# Altium project Main_PCB_EDR.PrjPcb
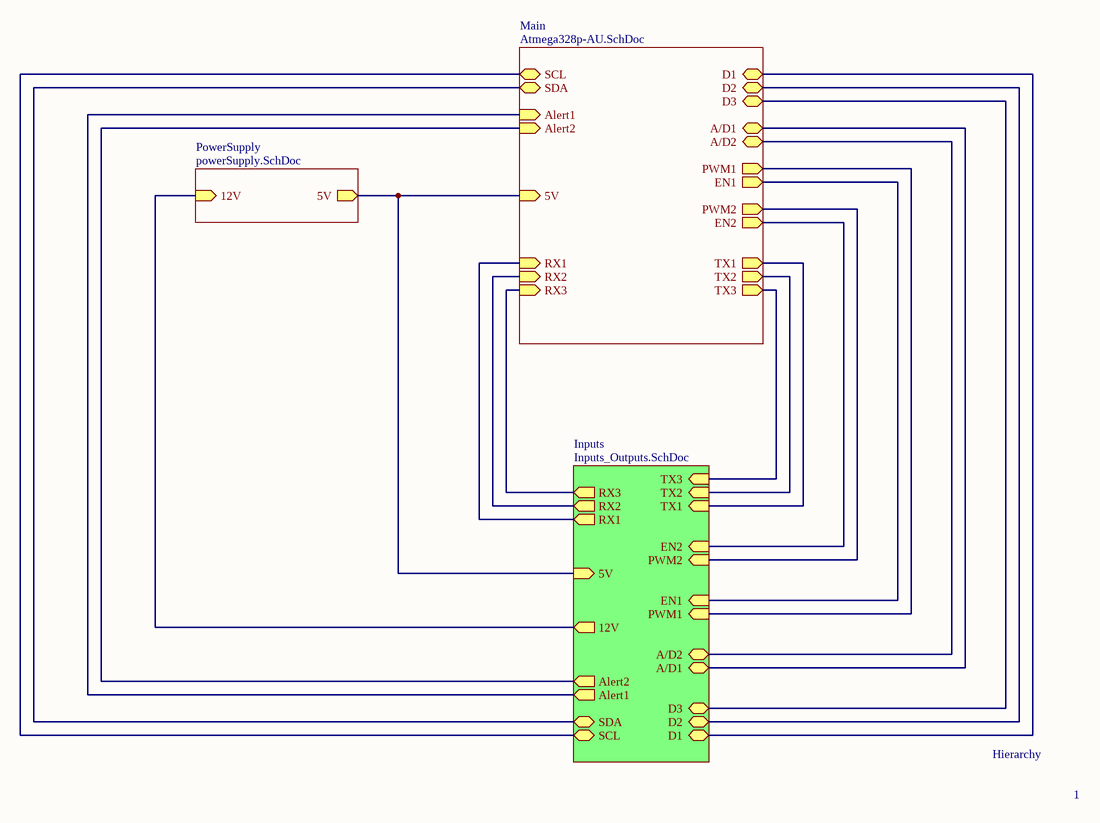
[diagram p0: Hierarchy.SchDoc]
4 sheets, 24 parts. Net scope: hierarchical (ports join the sheet entries above them; power ports are global).
Board file: PCB2.PcbDoc
Sheets:
  Hierarchy.SchDoc
    Main = Atmega328p-AU.SchDoc
    PowerSupply = powerSupply.SchDoc
    Inputs = Inputs_Outputs.SchDoc

## Sheet Hierarchy.SchDoc
size A4; SheetNumber: 1; SheetTotal: 4

### Sub-sheets
Inputs = Inputs_Outputs.SchDoc: Alert1 (out), Alert2 (out), 12V (out), SCL (bidir), SDA (bidir), TX3 (in), TX2 (in), TX1 (in), EN2 (in), PWM2 (in), EN1 (in), PWM1 (in), A/D2 (bidir), A/D1 (bidir), D3 (bidir), D2 (bidir), D1 (bidir), 5V (in), RX1 (out), RX2 (out), RX3 (out)
Main = Atmega328p-AU.SchDoc: PWM1 (out), EN1 (out), PWM2 (out), EN2 (out), 5V (in), Alert1 (in), Alert2 (in), SCL (bidir), SDA (bidir), RX1 (in), RX2 (in), RX3 (in), TX1 (out), TX2 (out), TX3 (out), D2 (bidir), D3 (bidir), D1 (bidir), A/D1 (bidir), A/D2 (bidir)
PowerSupply = powerSupply.SchDoc: 5V (out), 12V (in)

### Nets
+5: sheet Main/5V, sheet PowerSupply/5V, sheet Inputs/5V
NetA/D_1: sheet Main/A/D1, sheet Inputs/A/D1
NetA/D_2: sheet Main/A/D2, sheet Inputs/A/D2
NetC4_2: sheet PowerSupply/12V, sheet Inputs/12V
Netcurrent_sensor_1_1: sheet Main/SCL, sheet Inputs/SCL
Netcurrent_sensor_1_2: sheet Main/SDA, sheet Inputs/SDA
Netcurrent_sensor_1_3: sheet Main/Alert1, sheet Inputs/Alert1
Netcurrent_sensor_2_3: sheet Main/Alert2, sheet Inputs/Alert2
NetD_1: sheet Main/D1, sheet Inputs/D1
NetD_2: sheet Main/D2, sheet Inputs/D2
NetD_3: sheet Main/D3, sheet Inputs/D3
NetH-Bridge1_1: sheet Main/PWM1, sheet Inputs/PWM1
NetH-Bridge1_2: sheet Main/EN1, sheet Inputs/EN1
NetH-Bridge2_1: sheet Main/PWM2, sheet Inputs/PWM2
NetH-Bridge2_2: sheet Main/EN2, sheet Inputs/EN2
NetIC_23: sheet Main/RX1, sheet Inputs/RX1
NetIC_24: sheet Main/TX1, sheet Inputs/TX1
NetIC_25: sheet Main/RX2, sheet Inputs/RX2
NetIC_26: sheet Main/TX2, sheet Inputs/TX2
NetIC_30: sheet Main/RX3, sheet Inputs/RX3
NetIC_31: sheet Main/TX3, sheet Inputs/TX3

### Notes on the sheet
- Hierarchy
- 1

## Sheet Atmega328p-AU.SchDoc
size A4; SheetNumber: 2; SheetTotal: 4
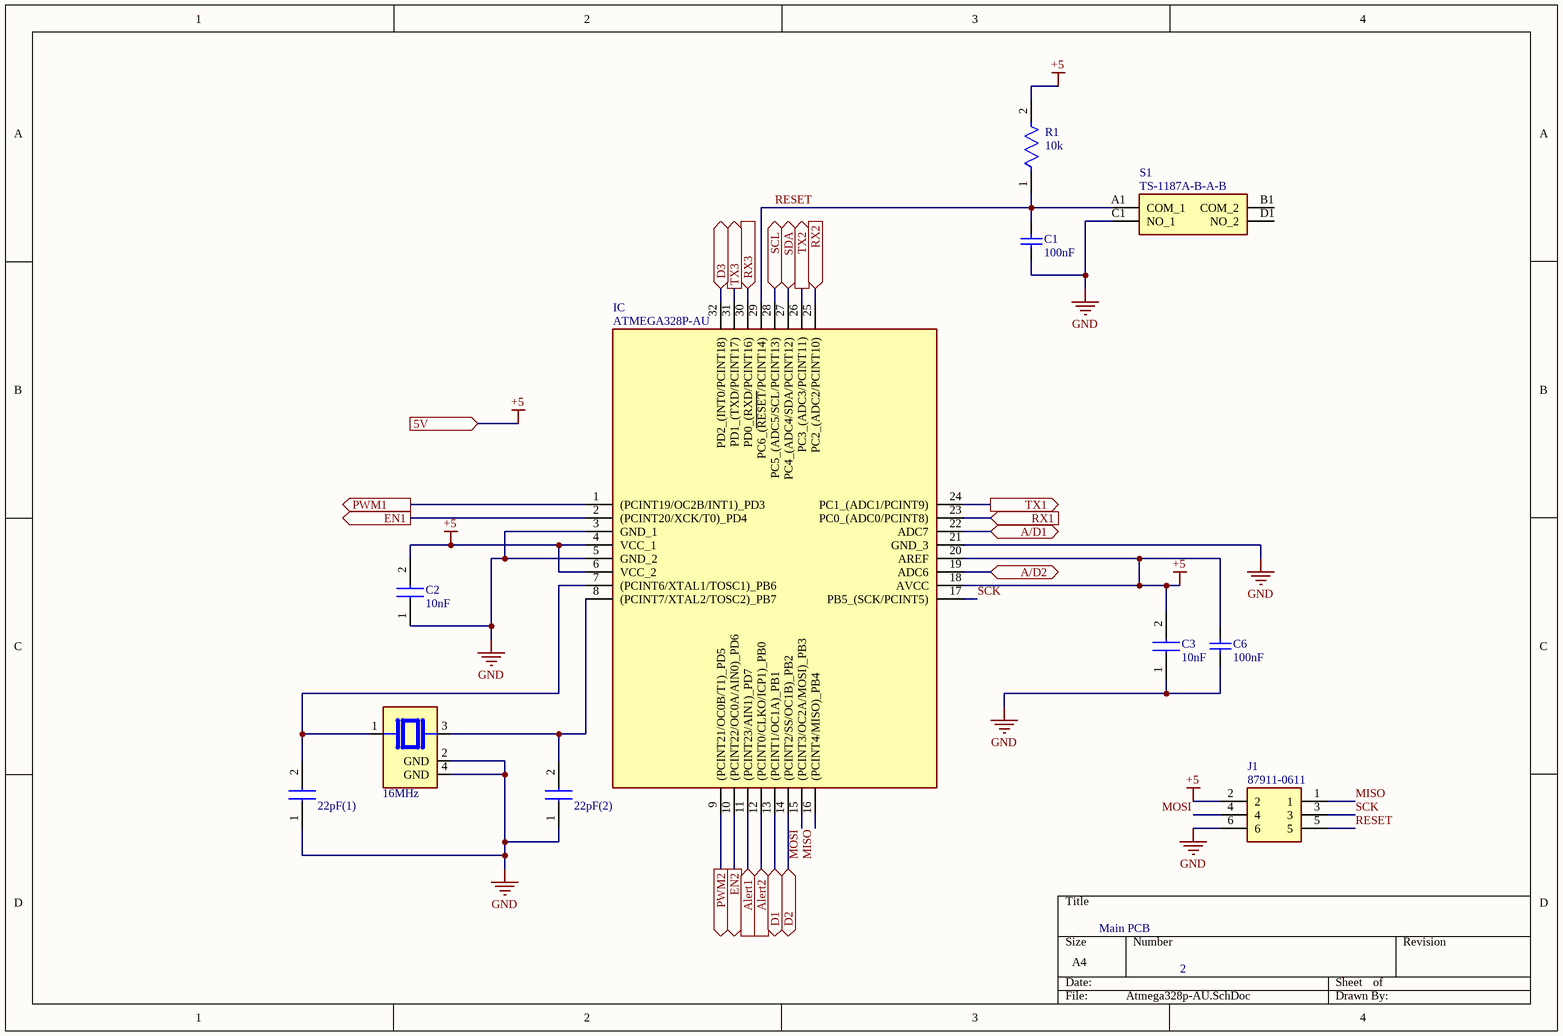
[diagram p1: Atmega328p-AU.SchDoc]

### Parts
16MHz  ABM11-16.000MHz-12-N1G-T  [XTAL_ABM11-16.000MHz-12-N1G-T]  (value not drawn)
22pF(1)  C1206C220JGGACTU  [C1206]  (value not drawn)
22pF(2)  C1206C220JGGACTU  [C1206]  (value not drawn)
C1  Capacitance: 100nF  [AVX-1206-2_L]  (hidden comment: 1206GC102KAT1A)
C2  10nF  [CAPC3216X94N]
C3  10nF  [CAPC3216X94N]
C6  Capacitance: 100nF  [AVX-1206-2_L]  (hidden comment: 1206GC102KAT1A)
IC  ATMEGA328P-AU  [QFP80P900X900X120-32N]
J1  87911-0611  [879110611]
R1  10k  [FP-RC1206-MFG]
S1  TS-1187A-B-A-B  [TS1187ABAB]

### Ports
5V (in, see Hierarchy[2B], Inputs_Outputs[2C], powerSupply[3B]), A/D1 (bidir, see Hierarchy[3B], Inputs_Outputs[3B]), A/D2 (bidir, see Hierarchy[3B], Inputs_Outputs[3B]), Alert1 (in, see Hierarchy[2B], Inputs_Outputs[2B]), Alert2 (in, see Hierarchy[2B], Inputs_Outputs[2B]), D1 (bidir, see Hierarchy[3A], Inputs_Outputs[3C]), D2 (bidir, see Hierarchy[3A], Inputs_Outputs[3C]), D3 (bidir, see Hierarchy[3A], Inputs_Outputs[3C]), EN1 (out, see Hierarchy[3B], Inputs_Outputs[3A]), EN2 (out, see Hierarchy[3B], Inputs_Outputs[3B]), PWM1 (out, see Hierarchy[3B], Inputs_Outputs[3A]), PWM2 (out, see Hierarchy[3B], Inputs_Outputs[3B]), RX1 (in, see Hierarchy[2B], Inputs_Outputs[2C]), RX2 (in, see Hierarchy[2B], Inputs_Outputs[2C]), RX3 (in, see Hierarchy[2B], Inputs_Outputs[2D]), SCL (bidir, see Hierarchy[2A], Inputs_Outputs[2B]), SDA (bidir, see Hierarchy[2A], Inputs_Outputs[2B]), TX1 (out, see Hierarchy[3B], Inputs_Outputs[2C]), TX2 (out, see Hierarchy[3B], Inputs_Outputs[2C]), TX3 (out, see Hierarchy[3B], Inputs_Outputs[2D])

### Nets
+5: C2.2 C3.2 C6.2 IC.4(VCC_1) IC.6(VCC_2) IC.18(AVCC) IC.20(AREF) J1.2 R1.2 ; port 5V
GND: 16MHz.2(GND) 16MHz.4(GND) 22pF(1).1 22pF(2).1 C1.1 C2.1 C3.1 C6.1 IC.3(GND_1) IC.5(GND_2) IC.21(GND_3) J1.6 S1.C1(NO_1)
MISO: IC.16((PCINT4/MISO)_PB4) J1.1
MOSI: IC.15((PCINT3/OC2A/MOSI)_PB3) J1.4
RESET: C1.2 IC.29(PC6_(~{RESET}/PCINT14)) J1.5 R1.1 S1.A1(COM_1)
SCK: IC.17(PB5_(SCK/PCINT5)) J1.3
Net16MHz_1: 16MHz.1 22pF(1).2 IC.7((PCINT6/XTAL1/TOSC1)_PB6)
Net16MHz_3: 16MHz.3 22pF(2).2 IC.8((PCINT7/XTAL2/TOSC2)_PB7)
NetA/D_1: IC.22(ADC7) ; port A/D1
NetA/D_2: IC.19(ADC6) ; port A/D2
Netcurrent_sensor_1_1: IC.28(PC5_(ADC5/SCL/PCINT13)) ; port SCL
Netcurrent_sensor_1_2: IC.27(PC4_(ADC4/SDA/PCINT12)) ; port SDA
Netcurrent_sensor_1_3: IC.11((PCINT23/AIN1)_PD7) ; port Alert1
Netcurrent_sensor_2_3: IC.12((PCINT0/CLKO/ICP1)_PB0) ; port Alert2
NetD_1: IC.13((PCINT1/OC1A)_PB1) ; port D1
NetD_2: IC.14((PCINT2/SS/OC1B)_PB2) ; port D2
NetD_3: IC.32(PD2_(INT0/PCINT18)) ; port D3
NetH-Bridge1_1: IC.1((PCINT19/OC2B/INT1)_PD3) ; port PWM1
NetH-Bridge1_2: IC.2((PCINT20/XCK/T0)_PD4) ; port EN1
NetH-Bridge2_1: IC.9((PCINT21/OC0B/T1)_PD5) ; port PWM2
NetH-Bridge2_2: IC.10((PCINT22/OC0A/AIN0)_PD6) ; port EN2
NetIC_23: IC.23(PC0_(ADC0/PCINT8)) ; port RX1
NetIC_24: IC.24(PC1_(ADC1/PCINT9)) ; port TX1
NetIC_25: IC.25(PC2_(ADC2/PCINT10)) ; port RX2
NetIC_26: IC.26(PC3_(ADC3/PCINT11)) ; port TX2
NetIC_30: IC.30(PD0_(RXD/PCINT16)) ; port RX3
NetIC_31: IC.31(PD1_(TXD/PCINT17)) ; port TX3

Not connected (* = marked no-connect by the designer): S1 B1(COM_2) D1(NO_2)

### Notes on the sheet
- Main PCB
- 2

### Library data of the parts
16MHz = ABM11-16.000MHz-12-N1G-T: MF: {'manufacturer': u'Abracon LLC'}; Package: None; Price: None; Value: *; MP: ABM11-16.000MHz-12-N1G-T; Availability: Unavailable
22pF(1) 22pF(2) = C1206C220JGGACTU: Capacitor; Manufacturer_Name: KEMET; Datasheet Link: https://content.kemet.com/datasheets/KEM_C1009_C0G_HV_SMD.pdf; Manufacturer_Part_Number: C1206C220JGGACTU; Mouser Part Number: 80-C1206C220JGG; Mouser Price/Stock: https://www.mouser.co.uk/ProductDetail/KEMET/C1206C220JGGACTU?qs=bISZhnDGhxtrVzrFMq60vg%3D%3D
C1 C6 = CMP-2000-05468-1: Chip Capacitor, 1 nF, +/- 10%, -55 to 125 degC, 1206 (3216 Metric), RoHS, Tape and Reel; Manufacturer: AVX; Dielectric: X7R; Voltage Rating DC: 2000V; Package Reference: 1206; Datasheet Version: 11/2010; Mounting Technology: SurfaceMount; Manufacturer URL: http://www.avx.com/; Tolerance: 10%; Tolerance (%): ±10%; PartNumber: 1206GC102KAT1A; Datasheet URL: https://datasheet.ciiva.com/11787/0900766b80ed4c37-11787781.pdf; Package Description: 2-Pin SMD, Body 3.4 x 1.8 mm; Case Size/Dimension: 1206; Rated Voltage: 2000V
C2 C3 = KAM31BR81H103KT: Capacitor; Manufacturer_Name: Kyocera AVX; Datasheet Link: https://datasheets.kyocera-avx.com/AutoMLCCKAM.pdf; Height: 0.94mm; Manufacturer_Part_Number: KAM31BR81H103KT; Mouser Part Number: 581-KAM31BR81H103KT; Mouser Price/Stock: https://www.mouser.co.uk/ProductDetail/KYOCERA-AVX/KAM31BR81H103KT?qs=Jm2GQyTW%2FbjzijSUJGW%2FJA%3D%3D
IC = ATMEGA328P-AU: Integrated Circuit; Manufacturer_Name: Microchip; Datasheet Link: https://componentsearchengine.com/Datasheets/2/ATMEGA328P-AU.pdf; Height: 1.2mm; Manufacturer_Part_Number: ATMEGA328P-AU; Mouser Part Number: 556-ATMEGA328P-AU; Mouser Price/Stock: https://www.mouser.co.uk/ProductDetail/Microchip-Technology/ATMEGA328P-AU?qs=K8BHR703ZXiCmmgp6%2FGNmQ%3D%3D; Arrow Part Number: ATMEGA328P-AU; Arrow Price/Stock: https://www.arrow.com/en/products/atmega328p-au/microchip-technology?region=europe
J1 = 87911-0611: Connector; Manufacturer_Name: Molex; Datasheet Link: https://www.molex.com/content/dam/molex/molex-dot-com/products/automated/en-us/salesdrawingpdf/879/87911/879110611_sd.pdf; Height: 5.18mm; Manufacturer_Part_Number: 87911-0611; Mouser Part Number: 538-87911-0611; Mouser Price/Stock: https://www.mouser.co.uk/ProductDetail/Molex/87911-0611?qs=vTUKd8r8%252BfEYOBWrgoJ4qQ%3D%3D
R1 = CMP-2100-03681-2: RES SMD 0 OHM JUMPER 1/4W 1206; Manufacturer Part Number: RC1206JR-070RL; Manufacturer: YAGEO; Voltage Rating: 200V; Temperature Coefficient: 300ppm/°C; Power Rating: 0.25W; Value: 0Ω; Tolerance: 5%; Temperature Range Low: -55°C; Category: Res; Automotive: No; Ipc Land Pattern Name: RESC310160X55; Device Class L1: Passive Components; Temperature: -55°C to +155°C; ComponentLink2URL: https://www.yageo.com/upload/media/product/productsearch/datasheet/rchip/PYu-RC_Group_51_RoHS_L_10.pdf; Lead Free: Yes; Height: 0.65mm; Footprint Url: https://www.yageo.com/upload/website/yageo_PYu-R_Mount_10_19050818_343.pdf; Package: RC1206; Digikey Description: RES SMD 0 OHM JUMPER 1/4W 1206; Temperature Range High: +155°C; Device Class L3: Chip SMD Resistors; Device Class L2: Resistors; Octopart: https://octopart.com/rc1206jr-070rl-yageo-40025601; Resistance: 0Ω; Series: RC; ComponentLink2Description: Datasheet; Composition: Thick Film; RoHS: TRUE; Mouser Description: Resistor: thick film; SMD; 1206; 0O; 0.25W; ±5%; -55÷155°C
S1 = TS-1187A-B-A-B: Switch; Manufacturer_Name: XKB Connectivity; Datasheet Link: http://www.helloxkb.com/public/images/pdf/TS-1187A-X-X-X.pdf; Height: 4.05mm; Manufacturer_Part_Number: TS-1187A-B-A-B

## Sheet powerSupply.SchDoc
size A4; SheetNumber: 3; SheetTotal: 4
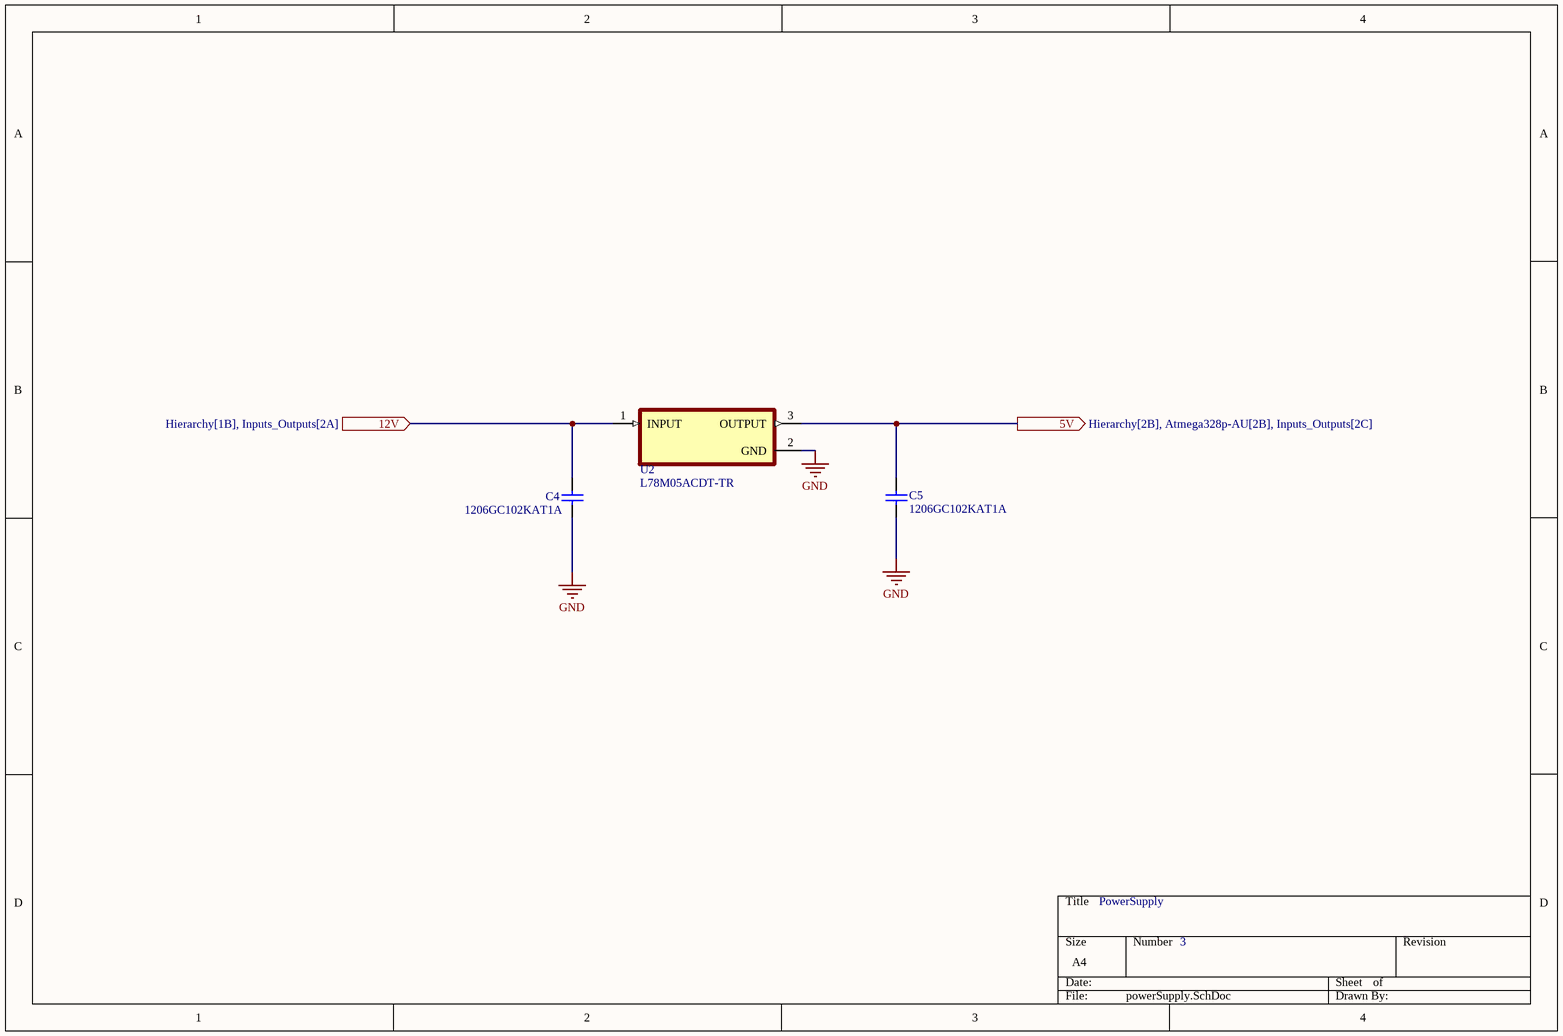
[diagram p2: powerSupply.SchDoc]

### Parts
C4  1206GC102KAT1A  [AVX-1206-2_L]
C5  1206GC102KAT1A  [AVX-1206-2_L]
U2  L78M05ACDT-TR  [DPAK228P972X240-4N]

### Ports
5V (out, see Hierarchy[2B], Atmega328p-AU[2B], Inputs_Outputs[2C]), 12V (in, see Hierarchy[1B], Inputs_Outputs[2A])

### Nets
+5: C5.1 U2.3(OUTPUT) ; port 5V
GND: C4.1 C5.2 U2.2(GND)
NetC4_2: C4.2 U2.1(INPUT) ; port 12V

### Notes on the sheet
- PowerSupply
- 3

### Library data of the parts
C4 C5 = CMP-2000-05468-1: Chip Capacitor, 1 nF, +/- 10%, -55 to 125 degC, 1206 (3216 Metric), RoHS, Tape and Reel; Manufacturer: AVX; Capacitance: 0.001uF; Dielectric: X7R; Voltage Rating DC: 2000V; Package Reference: 1206; Datasheet Version: 11/2010; Mounting Technology: SurfaceMount; Manufacturer URL: http://www.avx.com/; Tolerance: 10%; Tolerance (%): ±10%; PartNumber: 1206GC102KAT1A; Datasheet URL: https://datasheet.ciiva.com/11787/0900766b80ed4c37-11787781.pdf; Package Description: 2-Pin SMD, Body 3.4 x 1.8 mm; Case Size/Dimension: 1206; Rated Voltage: 2000V
U2 = L78M05ACDT-TR: Linear Voltage Regulator IC 1 Output 500mA DPAK; MF: STMicroelectronics; Availability: Unavailable; MP: L78M05ACDT-TR; Price: None; Value: *; SnapEDA_Link: https://www.snapeda.com/parts/L78M05ACDT-TR/STMicroelectronics/view-part/274303/?ref=snap; Package: TO-252-3 STMicroelectronics

## Sheet Inputs_Outputs.SchDoc
size A4; SheetNumber: 4; SheetTotal: 4
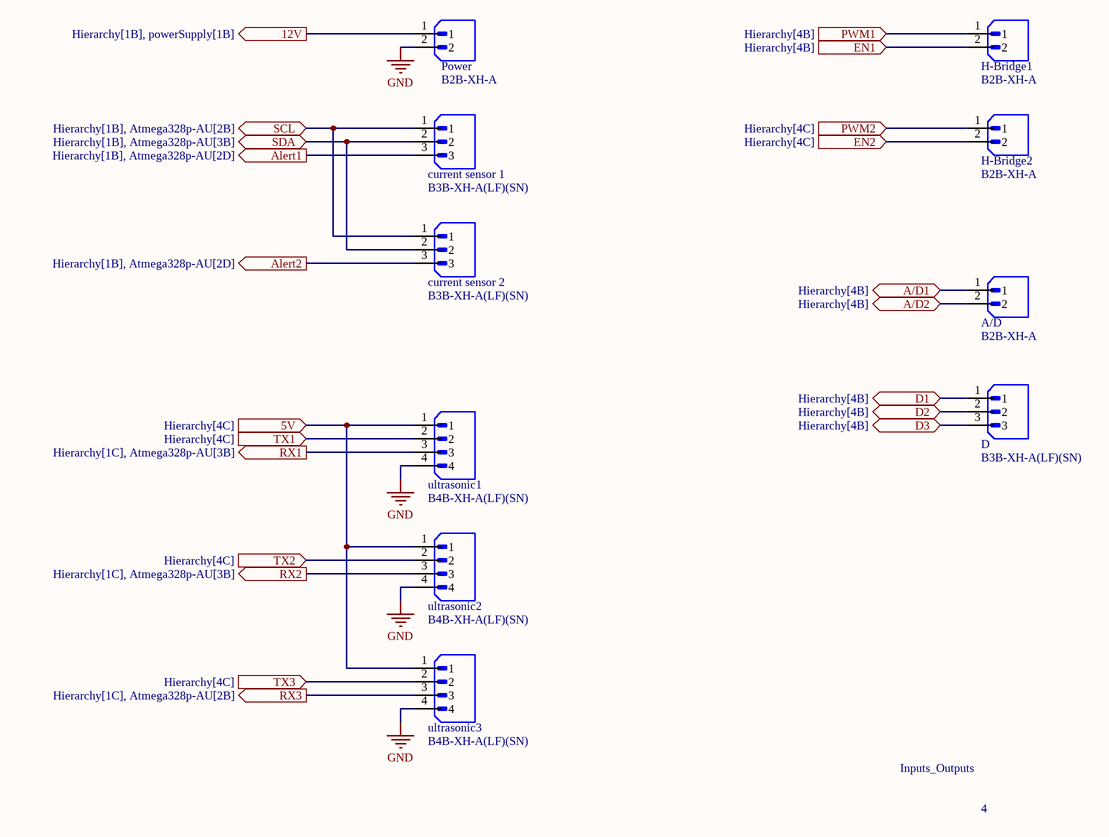
[diagram p3: Inputs_Outputs.SchDoc]

### Parts
A/D  B2B-XH-A  [JST_B2B-XH-A]
current_sensor_1  B3B-XH-A(LF)(SN)  [JST_B3B-XH-A(LF)(SN)]
current_sensor_2  B3B-XH-A(LF)(SN)  [JST_B3B-XH-A(LF)(SN)]
D  B3B-XH-A(LF)(SN)  [JST_B3B-XH-A(LF)(SN)]
H-Bridge1  B2B-XH-A  [JST_B2B-XH-A]
H-Bridge2  B2B-XH-A  [JST_B2B-XH-A]
Power  B2B-XH-A  [JST_B2B-XH-A]
ultrasonic1  B4B-XH-A(LF)(SN)  [JST_B4B-XH-A(LF)(SN)]
ultrasonic2  B4B-XH-A(LF)(SN)  [JST_B4B-XH-A(LF)(SN)]
ultrasonic3  B4B-XH-A(LF)(SN)  [JST_B4B-XH-A(LF)(SN)]

### Ports
5V (in, see Hierarchy[4C]), 12V (out, see Hierarchy[1B], powerSupply[1B]), A/D1 (bidir, see Hierarchy[4B]), A/D2 (bidir, see Hierarchy[4B]), Alert1 (out, see Hierarchy[1B], Atmega328p-AU[2D]), Alert2 (out, see Hierarchy[1B], Atmega328p-AU[2D]), D1 (bidir, see Hierarchy[4B]), D2 (bidir, see Hierarchy[4B]), D3 (bidir, see Hierarchy[4B]), EN1 (in, see Hierarchy[4B]), EN2 (in, see Hierarchy[4C]), PWM1 (in, see Hierarchy[4B]), PWM2 (in, see Hierarchy[4C]), RX1 (out, see Hierarchy[1C], Atmega328p-AU[3B]), RX2 (out, see Hierarchy[1C], Atmega328p-AU[3B]), RX3 (out, see Hierarchy[1C], Atmega328p-AU[2B]), SCL (bidir, see Hierarchy[1B], Atmega328p-AU[2B]), SDA (bidir, see Hierarchy[1B], Atmega328p-AU[3B]), TX1 (in, see Hierarchy[4C]), TX2 (in, see Hierarchy[4C]), TX3 (in, see Hierarchy[4C])

### Nets
+5: ultrasonic1.1 ultrasonic2.1 ultrasonic3.1 ; port 5V
GND: Power.2 ultrasonic1.4 ultrasonic2.4 ultrasonic3.4
NetA/D_1: A/D.1 ; port A/D1
NetA/D_2: A/D.2 ; port A/D2
NetC4_2: Power.1 ; port 12V
Netcurrent_sensor_1_1: current_sensor_1.1 current_sensor_2.1 ; port SCL
Netcurrent_sensor_1_2: current_sensor_1.2 current_sensor_2.2 ; port SDA
Netcurrent_sensor_1_3: current_sensor_1.3 ; port Alert1
Netcurrent_sensor_2_3: current_sensor_2.3 ; port Alert2
NetD_1: D.1 ; port D1
NetD_2: D.2 ; port D2
NetD_3: D.3 ; port D3
NetH-Bridge1_1: H-Bridge1.1 ; port PWM1
NetH-Bridge1_2: H-Bridge1.2 ; port EN1
NetH-Bridge2_1: H-Bridge2.1 ; port PWM2
NetH-Bridge2_2: H-Bridge2.2 ; port EN2
NetIC_23: ultrasonic1.3 ; port RX1
NetIC_24: ultrasonic1.2 ; port TX1
NetIC_25: ultrasonic2.3 ; port RX2
NetIC_26: ultrasonic2.2 ; port TX2
NetIC_30: ultrasonic3.3 ; port RX3
NetIC_31: ultrasonic3.2 ; port TX3

### Notes on the sheet
- Inputs_Outputs
- 4

### Library data of the parts
A/D H-Bridge1 H-Bridge2 Power = B2B-XH-A: MF: {'manufacturer': u'JST Sales America Inc.'}; Package: None; Price: None; Value: *; MP: B2B-XH-A; Availability: Unavailable
current_sensor_1 current_sensor_2 D = B3B-XH-A(LF)(SN): Connector Header Through Hole 3 position 0.098 (2.50mm); MF: JST Sales; SnapEDA_Link: https://www.snapeda.com/parts/B3B-XH-A(LF)(SN)/JST+Sales+America+Inc./view-part/?ref=snap; Package: None; Value: *; MP: B3B-XH-A(LF)(SN); Check_prices: https://www.snapeda.com/parts/B3B-XH-A(LF)(SN)/JST+Sales+America+Inc./view-part/?ref=eda
ultrasonic1-ultrasonic3 = B4B-XH-A(LF)(SN): Connector Header Through Hole 4 position 0.098 (2.50mm); MF: JST Sales; SnapEDA_Link: https://www.snapeda.com/parts/B4B-XH-A(LF)(SN)/JST+Sales+America+Inc./view-part/?ref=snap; Package: None; Value: *; MP: B4B-XH-A(LF)(SN); Check_prices: https://www.snapeda.com/parts/B4B-XH-A(LF)(SN)/JST+Sales+America+Inc./view-part/?ref=eda

## Nets that join several sheets
+5: Atmega328p-AU (9 pins), powerSupply (C5.1 U2.3), Inputs_Outputs (ultrasonic1.1 ultrasonic2.1 ultrasonic3.1)
GND: Atmega328p-AU (13 pins), powerSupply (C4.1 C5.2 U2.2), Inputs_Outputs (Power.2 ultrasonic1.4 ultrasonic2.4 ultrasonic3.4)
NetA/D_1: Atmega328p-AU (IC.22), Inputs_Outputs (A/D.1)
NetA/D_2: Atmega328p-AU (IC.19), Inputs_Outputs (A/D.2)
NetC4_2: powerSupply (C4.2 U2.1), Inputs_Outputs (Power.1)
Netcurrent_sensor_1_1: Atmega328p-AU (IC.28), Inputs_Outputs (current_sensor_1.1 current_sensor_2.1)
Netcurrent_sensor_1_2: Atmega328p-AU (IC.27), Inputs_Outputs (current_sensor_1.2 current_sensor_2.2)
Netcurrent_sensor_1_3: Atmega328p-AU (IC.11), Inputs_Outputs (current_sensor_1.3)
Netcurrent_sensor_2_3: Atmega328p-AU (IC.12), Inputs_Outputs (current_sensor_2.3)
NetD_1: Atmega328p-AU (IC.13), Inputs_Outputs (D.1)
NetD_2: Atmega328p-AU (IC.14), Inputs_Outputs (D.2)
NetD_3: Atmega328p-AU (IC.32), Inputs_Outputs (D.3)
NetH-Bridge1_1: Atmega328p-AU (IC.1), Inputs_Outputs (H-Bridge1.1)
NetH-Bridge1_2: Atmega328p-AU (IC.2), Inputs_Outputs (H-Bridge1.2)
NetH-Bridge2_1: Atmega328p-AU (IC.9), Inputs_Outputs (H-Bridge2.1)
NetH-Bridge2_2: Atmega328p-AU (IC.10), Inputs_Outputs (H-Bridge2.2)
NetIC_23: Atmega328p-AU (IC.23), Inputs_Outputs (ultrasonic1.3)
NetIC_24: Atmega328p-AU (IC.24), Inputs_Outputs (ultrasonic1.2)
NetIC_25: Atmega328p-AU (IC.25), Inputs_Outputs (ultrasonic2.3)
NetIC_26: Atmega328p-AU (IC.26), Inputs_Outputs (ultrasonic2.2)
NetIC_30: Atmega328p-AU (IC.30), Inputs_Outputs (ultrasonic3.3)
NetIC_31: Atmega328p-AU (IC.31), Inputs_Outputs (ultrasonic3.2)